# Altium project MC3_r2.PrjPcb (part 7 of 10)

## Sheet TPS_secondary_wiper.SchDoc
size A; DocumentNumber: D_19; SheetNumber: 19; SheetTotal: 21
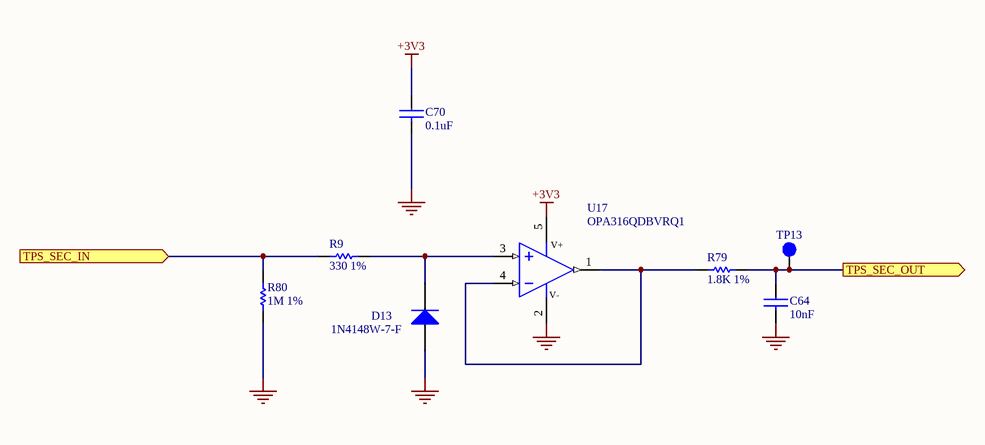
[diagram p13: TPS_secondary_wiper.SchDoc]

### Parts
C64  10nF  [C0805]
C70  0.1uF  [C0805]
D13  1N4148W-7-F  [DIOD-SOD123-2_V]
R9  330 1%  [R0805]
R79  1.8K 1%  [R0805]
R80  1M 1%  [R0805]
TP13  T  [TESTPOINTSMD_1x1MM]  (value not drawn)  (no BOM)
U17  OPA316QDBVRQ1  [DBV0005A_M]

### Ports
TPS_SEC_IN (in), TPS_SEC_OUT (out)

### Nets
+3V3: C70.1 U17.5(V+)
GND: C64.2 C70.2 D13.1(A) R80.1 U17.2(V-)
TPS_SEC: R9.1 R80.2 ; port TPS_SEC_IN
TPS_SECAD: C64.1 R79.2 TP13.1 ; port TPS_SEC_OUT
NetD13_2: D13.2(K) R9.2 U17.3(IN+)
NetR79_1: R79.1 U17.1(OUT) U17.4(IN-)

### Library data of the parts
C64 = CC0805KRX7R9BB103: YAGEO - CC0805KRX7R9BB103 - SMD Multilayer Ceramic Capacitor, 10000 pF, 50 V, 0805 [2012 Metric], ± 10%, X7R, CC Series; Voltage Rating: 50V; Insulation Resistance: 100GR; Supplier 1: Mouser; Supplier Part Number 1: 603-CC805KRX7R9BB103; Manufacturer: Yageo; Manufacturer Part Number: CC0805KRX7R9BB103; RoHS: Yes; Category: Ceramic Capacitors; Stock 1: 473100; Pricing 1: 1=0.11000, 10=0.05700, 100=0.02600, 1000=0.02100, 4000=0.01600, 8000=0.01400 (USD); Mount: Surface Mount; Case/Package: 0805; Number of Pins: 2; Case Code (Imperial): 0805; Case Code (Metric): 2012; Material: Ceramic; Min Operating Temperature: -55°C; Max Operating Temperature: 125°C; Packaging: Tape and Reel; Capacitance: 10nF; Tolerance: 10%; Package Quantity: 1; Dielectric: X7R; Termination: SMD/SMT; Voltage Rating (DC): 50V; Voltage: 50V; Composition: Ceramic; Length: 2mm; Height: 0.6mm; Width: 1.25mm; Depth: 1.25mm; Thickness: 0.024inch; Radiation Hardening: No; REACH SVHC: No SVHC; Lead Free: Lead Free; Halogen Free: Halogen Free; ComponentLink1URL: https://datasheet.ciiva.com/11786/0900766b80d84f1d-11786119.pdf?src-supplier=RSComponents; ComponentLink1Description: https://datasheet.ciiva.com/11786/0900766b80d84f1d-11786119.pdf?src-supplier=RSComponents; ComponentLink2URL: https://datasheet.ciiva.com/25613/0900766b8027bcf6-25613113.pdf?src-supplier=RSComponents; ComponentLink2Description: https://datasheet.ciiva.com/25613/0900766b8027bcf6-25613113.pdf?src-supplier=RSComponents; ComponentLink3URL: https://datasheet.ciiva.com/144/mlccorderingcode-144533.pdf?src-supplier=Digi-Key; ComponentLink3Description: https://datasheet.ciiva.com/144/mlccorderingcode-144533.pdf?src-supplier=Digi-Key; ComponentLink4URL: https://datasheet.ciiva.com/144/mlccorderingcode-144534.pdf?src-supplier=Digi-Key; ComponentLink4Description: https://datasheet.ciiva.com/144/mlccorderingcode-144534.pdf?src-supplier=Digi-Key; ComponentLink5URL: https://datasheet.ciiva.com/46372/1784427-46372638.pdf?src-supplier=Element14; ComponentLink5Description: https://datasheet.ciiva.com/46372/1784427-46372638.pdf?src-supplier=Element14; ComponentLink6URL: https://datasheet.ciiva.com/144/mlccorderingcode-144532.pdf?src-supplier=Digi-Key; ComponentLink6Description: https://datasheet.ciiva.com/144/mlccorderingcode-144532.pdf?src-supplier=Digi-Key; ComponentLink7URL: https://datasheet.ciiva.com/16625/upy-gphc-x7r-6-3v-to-50v-8-16625548.pdf?src-supplier=Avnet+Europe; ComponentLink7Description: https://datasheet.ciiva.com/16625/upy-gphc-x7r-6-3v-to-50v-8-16625548.pdf?src-supplier=Avnet+Europe; ComponentLink8URL: https://datasheet.ciiva.com/22749/1489800-22749215.pdf?src-supplier=Element14; ComponentLink8Description: https://datasheet.ciiva.com/22749/1489800-22749215.pdf?src-supplier=Element14; ComponentLink9URL: https://datasheet.ciiva.com/46372/1734573-46372639.pdf?src-supplier=Element14; ComponentLink9Description: https://datasheet.ciiva.com/46372/1734573-46372639.pdf?src-supplier=Element14
C70 = C0805C104K5RACTU: Cap Ceramic 0.1uF 50V X7R 10% SMD 2.0 x 1.2 mm 125 C Paper T/R; Manufacturer: KEMET; Capacitance: 100nF; Voltage: 500V; Supplier 1: Mouser; Supplier Part Number 1: 80-C0805C104K5R; Manufacturer Part Number: C0805C104K5RACTU; RoHS: Yes; Category: Ceramic Capacitors; Stock 1: 4177670; Pricing 1: 1=0.17000, 10=0.10400, 100=0.05600, 500=0.03900, 1000=0.03200, 4000=0.02400 (USD); Mount: Surface Mount,PCB; Case/Package: 0805; Number of Pins: 2; Case Code (Imperial): 0805; Case Code (Metric): 2012; Dielectric Material: Ceramic; Contact Plating: Tin,Matte; Min Operating Temperature: -55°C; Max Operating Temperature: 125°C; Voltage Rating: 50V; Tolerance: 10%; Packaging: Tape and Reel; Dielectric: X7R; Package Quantity: 4000; Voltage Rating (DC): 50V; Termination: SMD/SMT; Length: 2mm; Height: 0.9mm; Width: 1.2mm; Depth: 1.25mm; Thickness: 0.035inch; Lead Pitch: 0.75mm; Radiation Hardening: No; REACH SVHC: No SVHC; ComponentLink1URL: https://datasheet.ciiva.com/14589/70095383-14589048.pdf?src-supplier=Allied+Electronics; ComponentLink1Description: https://datasheet.ciiva.com/14589/70095383-14589048.pdf?src-supplier=Allied+Electronics; ComponentLink2URL: https://datasheet.ciiva.com/28682/1851736-28682232.pdf?src-supplier=Element14; ComponentLink2Description: https://datasheet.ciiva.com/28682/1851736-28682232.pdf?src-supplier=Element14; ComponentLink3URL: https://datasheet.ciiva.com/32431/slceramic-chip-condensers-e-32431755.pdf?src-supplier=Distrelec; ComponentLink3Description: https://datasheet.ciiva.com/32431/slceramic-chip-condensers-e-32431755.pdf?src-supplier=Distrelec; ComponentLink4URL: https://datasheet.ciiva.com/18410/70095383-18410815.pdf?src-supplier=Allied+Electronics; ComponentLink4Description: https://datasheet.ciiva.com/18410/70095383-18410815.pdf?src-supplier=Allied+Electronics
D13 = 1N4148W-7-F: DIODE GEN PURP 100V 300MA SOD123; Manufacturer: Diodes; Reverse Recovery Time: 4ns; Forward Voltage: 1.25V; Element Configuration: Single; Forward Current: 150mA; Peak Non-Repetitive Surge Current: 2A; Power Dissipation: 400mW; Peak Reverse Current: 1uA; Polarity: Standard; Voltage Rating (DC): 75V; Capacitance: 2pF; Current: 15A; Supplier 1: Mouser; Supplier Part Number 1: 621-1N4148W-F; Manufacturer Part Number: 1N4148W-7-F; RoHS: Yes; Category: Rectifier Diodes; Stock 1: 1274151; Pricing 1: 1=0.16000, 10=0.15000, 100=0.05300, 1000=0.03500, 3000=0.02700, 9000=0.02400 (USD); Mount: Surface Mount; Number of Pins: 2; Weight: 0.000353oz; Contact Plating: Tin,Matte; Min Operating Temperature: -65°C; Max Operating Temperature: 150°C; Packaging: Tape and Reel; Max Repetitive Reverse Voltage (Vrrm): 100V; Package Quantity: 3000; Average Rectified Current: 300mA; Max Reverse Voltage (DC): 100V; Recovery Time: 4ns; Max Forward Surge Current (Ifsm): 2A; Max Surge Current: 2A; Current Rating: 150mA; Output Current: 150mA; Voltage: 100V; Power Rating: 400mW; Length: 2.85mm; Height: 1.25mm; Width: 1.7mm; Radiation Hardening: No; Lead Free: Lead Free; REACH SVHC: No SVHC; ComponentLink1URL: https://datasheet.ciiva.com/4435/ds30086-4435128.pdf?src-supplier=Mouser; ComponentLink1Description: https://datasheet.ciiva.com/4435/ds30086-4435128.pdf?src-supplier=Mouser; ComponentLink2URL: https://datasheet.ciiva.com/8300/ds30086-8300392.pdf?src-supplier=Avnet; ComponentLink2Description: https://datasheet.ciiva.com/8300/ds30086-8300392.pdf?src-supplier=Avnet; ComponentLink3URL: https://datasheet.ciiva.com/911/ds30086-911734.pdf?src-supplier=Digi-Key; ComponentLink3Description: https://datasheet.ciiva.com/911/ds30086-911734.pdf?src-supplier=Digi-Key; ComponentLink4URL: https://datasheet.ciiva.com/911/ds30086-911735.pdf?src-supplier=Digi-Key; ComponentLink4Description: https://datasheet.ciiva.com/911/ds30086-911735.pdf?src-supplier=Digi-Key; ComponentLink5URL: https://datasheet.ciiva.com/22695/1915529-22695239.pdf?src-supplier=Element14; ComponentLink5Description: https://datasheet.ciiva.com/22695/1915529-22695239.pdf?src-supplier=Element14; ComponentLink6URL: https://datasheet.ciiva.com/911/ds30086-911736.pdf?src-supplier=Digi-Key; ComponentLink6Description: https://datasheet.ciiva.com/911/ds30086-911736.pdf?src-supplier=Digi-Key; ComponentLink7URL: https://datasheet.ciiva.com/1179/1915529-1179304.pdf?src-supplier=Element14; ComponentLink7Description: https://datasheet.ciiva.com/1179/1915529-1179304.pdf?src-supplier=Element14; ComponentLink8URL: https://datasheet.ciiva.com/25919/ds30086-25919609.pdf?src-supplier=Avnet+Europe; ComponentLink8Description: https://datasheet.ciiva.com/25919/ds30086-25919609.pdf?src-supplier=Avnet+Europe; ComponentLink9URL: https://datasheet.ciiva.com/15219/getdatasheetpartid-110030-15219548.pdf?src-supplier=Verical; ComponentLink9Description: https://datasheet.ciiva.com/15219/getdatasheetpartid-110030-15219548.pdf?src-supplier=Verical; ComponentLink10URL: https://datasheet.ciiva.com/8303/ds30086-8303197.pdf?src-supplier=Avnet; ComponentLink10Description: https://datasheet.ciiva.com/8303/ds30086-8303197.pdf?src-supplier=Avnet
R9 = ERJ-6ENF3300V: RES SMD 330 OHM 1% 1/8W 0805; Manufacturer: Panasonic; Resistance: 330R; Temperature Coefficient: 100ppm/°C; Power Rating: 125mW; Voltage Rating: 150V; Supplier 1: Mouser; Supplier Part Number 1: 667-ERJ-6ENF3300V; Manufacturer Part Number: ERJ-6ENF3300V; RoHS: Yes; Category: Chip SMD Resistors; Stock 1: 121287; Pricing 1: 1=0.10000, 10=0.08900, 100=0.03500, 500=0.03500, 1000=0.01900, 5000=0.01700 (USD); Case/Package: 0805; Case Code (Imperial): 0805; Case Code (Metric): 2012; Contact Plating: Tin; Min Operating Temperature: -55°C; Max Operating Temperature: 155°C; Tolerance: 1%; Packaging: Tape and Reel; Composition: Thick Film; Termination: SMD/SMT; Package Quantity: 1; Military Standard: Not; Length: 2mm; Height: 0.6mm; Width: 1.2mm; Depth: 1.25mm; Radiation Hardening: No; REACH SVHC: No SVHC; ComponentLink1URL: https://datasheet.ciiva.com/11821/0900766b80f80784-11821635.pdf?src-supplier=RSComponents; ComponentLink1Description: https://datasheet.ciiva.com/11821/0900766b80f80784-11821635.pdf?src-supplier=RSComponents; ComponentLink2URL: https://datasheet.ciiva.com/30131/aoa0000ce2-30131349.pdf?src-supplier=Onlinecomponents.com; ComponentLink2Description: https://datasheet.ciiva.com/30131/aoa0000ce2-30131349.pdf?src-supplier=Onlinecomponents.com; ComponentLink3URL: https://datasheet.ciiva.com/24025/aoa0000ce2-24025991.pdf?src-supplier=Mouser; ComponentLink3Description: https://datasheet.ciiva.com/24025/aoa0000ce2-24025991.pdf?src-supplier=Mouser; ComponentLink4URL: https://datasheet.ciiva.com/17206/aoa0000ce2-17206152.pdf?src-supplier=Avnet+Europe; ComponentLink4Description: https://datasheet.ciiva.com/17206/aoa0000ce2-17206152.pdf?src-supplier=Avnet+Europe; ComponentLink5URL: https://datasheet.ciiva.com/46436/1678782-46436633.pdf?src-supplier=Element14; ComponentLink5Description: https://datasheet.ciiva.com/46436/1678782-46436633.pdf?src-supplier=Element14; ComponentLink6URL: https://datasheet.ciiva.com/46436/1678782-46436634.pdf?src-supplier=Element14; ComponentLink6Description: https://datasheet.ciiva.com/46436/1678782-46436634.pdf?src-supplier=Element14; ComponentLink7URL: https://datasheet.ciiva.com/16760/70260748-16760668.pdf?src-supplier=Allied+Electronics; ComponentLink7Description: https://datasheet.ciiva.com/16760/70260748-16760668.pdf?src-supplier=Allied+Electronics; ComponentLink8URL: https://datasheet.ciiva.com/16780/70260748-16780764.pdf?src-supplier=Allied+Electronics; ComponentLink8Description: https://datasheet.ciiva.com/16780/70260748-16780764.pdf?src-supplier=Allied+Electronics; ComponentLink9URL: https://datasheet.ciiva.com/22684/1678782-22684798.pdf?src-supplier=Element14; ComponentLink9Description: https://datasheet.ciiva.com/22684/1678782-22684798.pdf?src-supplier=Element14; ComponentLink10URL: https://datasheet.ciiva.com/28590/1678782-28590783.pdf?src-supplier=Element14; ComponentLink10Description: https://datasheet.ciiva.com/28590/1678782-28590783.pdf?src-supplier=Element14; Mount: Surface Mount; Number of Pins: 2; Number of Terminations: 2; Max Power Dissipation: 125mW; Features: Automotive AEC-Q200
R79 = ERJ-6ENF1801V: RESISTOR, 0805, 0.125W, 1%, 1K8; Manufacturer: Panasonic; Resistance: 1.8kR; Temperature Coefficient: 100ppm/°C; Voltage Rating: 150V; Power Rating: 125mW; Supplier 1: Mouser; Supplier Part Number 1: 667-ERJ-6ENF1801V; Manufacturer Part Number: ERJ-6ENF1801V; RoHS: Yes; Category: Chip SMD Resistors; Stock 1: 1306; Pricing 1: 1=0.12000, 10=0.08900, 100=0.03500, 1000=0.01700, 5000=0.01700, 10000=0.01700 (USD); Mount: Surface Mount; Case/Package: 0805; Number of Pins: 2; Case Code (Metric): 2012; Case Code (Imperial): 0805; Contact Plating: Tin; Min Operating Temperature: -55°C; Max Operating Temperature: 155°C; Packaging: Tape and Reel; Tolerance: 1%; Composition: Thick Film; Package Quantity: 1; Number of Terminations: 2; Max Power Dissipation: 125mW; Termination: SMD/SMT; Voltage Rating (DC): 150V; Features: Automotive AEC-Q200; Military Standard: Not; Length: 2mm; Height: 0.6mm; Width: 0.049inch; Depth: 1.25mm; REACH SVHC: No SVHC; ComponentLink1URL: https://datasheet.ciiva.com/11821/0900766b80f80784-11821574.pdf?src-supplier=RSComponents; ComponentLink1Description: https://datasheet.ciiva.com/11821/0900766b80f80784-11821574.pdf?src-supplier=RSComponents; ComponentLink2URL: https://datasheet.ciiva.com/17214/aoa0000ce2-17214517.pdf?src-supplier=Avnet+Europe; ComponentLink2Description: https://datasheet.ciiva.com/17214/aoa0000ce2-17214517.pdf?src-supplier=Avnet+Europe; ComponentLink3URL: https://datasheet.ciiva.com/7887/426256-7887030.pdf?src-supplier=Element14; ComponentLink3Description: https://datasheet.ciiva.com/7887/426256-7887030.pdf?src-supplier=Element14; ComponentLink4URL: https://datasheet.ciiva.com/16763/70260748-16763351.pdf?src-supplier=Allied+Electronics; ComponentLink4Description: https://datasheet.ciiva.com/16763/70260748-16763351.pdf?src-supplier=Allied+Electronics; ComponentLink5URL: https://datasheet.ciiva.com/22673/1678782-22673704.pdf?src-supplier=Element14; ComponentLink5Description: https://datasheet.ciiva.com/22673/1678782-22673704.pdf?src-supplier=Element14; ComponentLink6URL: https://datasheet.ciiva.com/46420/1678782-46420328.pdf?src-supplier=Element14; ComponentLink6Description: https://datasheet.ciiva.com/46420/1678782-46420328.pdf?src-supplier=Element14; ComponentLink7URL: https://datasheet.ciiva.com/16512/aoa0000ce2-16512137.pdf?src-supplier=Avnet+Asia; ComponentLink7Description: https://datasheet.ciiva.com/16512/aoa0000ce2-16512137.pdf?src-supplier=Avnet+Asia; ComponentLink8URL: https://datasheet.ciiva.com/6138/426256-6138778.pdf?src-supplier=Farnell; ComponentLink8Description: https://datasheet.ciiva.com/6138/426256-6138778.pdf?src-supplier=Farnell; ComponentLink9URL: https://datasheet.ciiva.com/16760/70260748-16760811.pdf?src-supplier=Allied+Electronics; ComponentLink9Description: https://datasheet.ciiva.com/16760/70260748-16760811.pdf?src-supplier=Allied+Electronics; ComponentLink10URL: https://datasheet.ciiva.com/24024/aoa0000ce2-24024172.pdf?src-supplier=Mouser; ComponentLink10Description: https://datasheet.ciiva.com/24024/aoa0000ce2-24024172.pdf?src-supplier=Mouser; ComponentLink11URL: https://datasheet.ciiva.com/7886/426256-7886751.pdf?src-supplier=Element14; ComponentLink11Description: https://datasheet.ciiva.com/7886/426256-7886751.pdf?src-supplier=Element14; ComponentLink12URL: https://datasheet.ciiva.com/30154/aoa0000ce2-30154047.pdf?src-supplier=Onlinecomponents.com; ComponentLink12Description: https://datasheet.ciiva.com/30154/aoa0000ce2-30154047.pdf?src-supplier=Onlinecomponents.com
R80 = ERJ-6ENF1004V: Res Thick Film 0805 1M Ohm 1% 1/8W 100ppm/C Molded SMD Punched Carrier T/R; Manufacturer: Panasonic; Resistance: 1MR; Temperature Coefficient: 100ppm/°C; Power Rating: 125mW; Voltage Rating: 150V; Supplier 1: Mouser; Supplier Part Number 1: 667-ERJ-6ENF1004V; Manufacturer Part Number: ERJ-6ENF1004V; RoHS: Yes; Category: Chip SMD Resistors; Stock 1: 196038; Pricing 1: 1=0.10000, 10=0.07300, 100=0.02800, 1000=0.01700, 5000=0.01700, 10000=0.01700, 25000=0.01400, 50000=0.01000, 100000=0.00900 (USD); Mount: Surface Mount; Case/Package: 0805; Number of Pins: 2; Case Code (Imperial): 0805; Case Code (Metric): 2012; Contact Plating: Tin; Min Operating Temperature: -55°C; Max Operating Temperature: 155°C; Packaging: Tape and Reel; Tolerance: 1%; Composition: Thick Film; Package Quantity: 1; Termination: SMD/SMT; Number of Terminations: 2; Max Power Dissipation: 125mW; Voltage Rating (DC): 150V; Features: Automotive AEC-Q200; Military Standard: Not; Length: 2mm; Height: 0.6mm; Width: 1.2mm; Depth: 1.25mm; Radiation Hardening: No; Lead Free: Lead Free; REACH SVHC: No SVHC; ComponentLink1URL: https://datasheet.ciiva.com/11821/0900766b80f80784-11821573.pdf?src-supplier=RSComponents; ComponentLink1Description: https://datasheet.ciiva.com/11821/0900766b80f80784-11821573.pdf?src-supplier=RSComponents; ComponentLink2URL: https://datasheet.ciiva.com/16761/70260748-16761141.pdf?src-supplier=Allied+Electronics; ComponentLink2Description: https://datasheet.ciiva.com/16761/70260748-16761141.pdf?src-supplier=Allied+Electronics; ComponentLink3URL: https://datasheet.ciiva.com/22749/426256-22749637.pdf?src-supplier=Element14; ComponentLink3Description: https://datasheet.ciiva.com/22749/426256-22749637.pdf?src-supplier=Element14; ComponentLink4URL: https://datasheet.ciiva.com/30161/aoa0000ce2-30161525.pdf?src-supplier=Onlinecomponents.com; ComponentLink4Description: https://datasheet.ciiva.com/30161/aoa0000ce2-30161525.pdf?src-supplier=Onlinecomponents.com; ComponentLink5URL: https://datasheet.ciiva.com/48532/aoa0000ce2-48532149.pdf?src-supplier=Avnet; ComponentLink5Description: https://datasheet.ciiva.com/48532/aoa0000ce2-48532149.pdf?src-supplier=Avnet; ComponentLink6URL: https://datasheet.ciiva.com/8079/426256-8079622.pdf?src-supplier=Element14; ComponentLink6Description: https://datasheet.ciiva.com/8079/426256-8079622.pdf?src-supplier=Element14; ComponentLink7URL: https://datasheet.ciiva.com/27055/1988997-27055735.pdf?src-supplier=Jameco; ComponentLink7Description: https://datasheet.ciiva.com/27055/1988997-27055735.pdf?src-supplier=Jameco; ComponentLink8URL: https://datasheet.ciiva.com/5868/426256-5868184.pdf?src-supplier=Farnell; ComponentLink8Description: https://datasheet.ciiva.com/5868/426256-5868184.pdf?src-supplier=Farnell; ComponentLink9URL: https://datasheet.ciiva.com/46420/1678782-46420186.pdf?src-supplier=Element14; ComponentLink9Description: https://datasheet.ciiva.com/46420/1678782-46420186.pdf?src-supplier=Element14; ComponentLink10URL: https://datasheet.ciiva.com/16788/70260748-16788299.pdf?src-supplier=Allied+Electronics; ComponentLink10Description: https://datasheet.ciiva.com/16788/70260748-16788299.pdf?src-supplier=Allied+Electronics; ComponentLink11URL: https://datasheet.ciiva.com/7909/426256-7909229.pdf?src-supplier=Element14; ComponentLink11Description: https://datasheet.ciiva.com/7909/426256-7909229.pdf?src-supplier=Element14; ComponentLink12URL: https://datasheet.ciiva.com/15158/getdatasheetpartid-246555-15158845.pdf?src-supplier=Verical; ComponentLink12Description: https://datasheet.ciiva.com/15158/getdatasheetpartid-246555-15158845.pdf?src-supplier=Verical; ComponentLink13URL: https://datasheet.ciiva.com/16449/aoa0000ce2-16449407.pdf?src-supplier=Future+Electronics; ComponentLink13Description: https://datasheet.ciiva.com/16449/aoa0000ce2-16449407.pdf?src-supplier=Future+Electronics; ComponentLink14URL: https://datasheet.ciiva.com/17215/aoa0000ce2-17215247.pdf?src-supplier=Avnet+Europe; ComponentLink14Description: https://datasheet.ciiva.com/17215/aoa0000ce2-17215247.pdf?src-supplier=Avnet+Europe
TP13 = TestPoint_SMD_1x1: SMD Test Point
U17 = OPA316QDBVRQ1: Op Amp Single Low Power Amplifier R-R I/O ±2.75V/5.5V Automotive 5-Pin SOT-23 T/R; Manufacturer: Texas Instruments; Number of Circuits: 1; Slew Rate: 6V/µs; Gain Bandwidth Product: 10MHz; Input Bias Current: 5pA; Input Offset Voltage (Vos): 500uV; Operating Supply Current: 400uA; Output Current per Channel: 50mA; Supplier 1: Mouser; Supplier Part Number 1: 595-OPA316QDBVRQ1; Manufacturer Part Number: OPA316QDBVRQ1; RoHS: No; Category: Amplifiers - Op Amps, Buffer, Instrumentation; Stock 1: 4457; Pricing 1: 1=1.37000, 10=1.16000, 100=0.89100, 250=0.78700, 500=0.74600, 1000=0.58000 (USD); Mount: Surface Mount; Case/Package: SOT-23-5; Min Operating Temperature: -40°C; Max Operating Temperature: 125°C; Packaging: Tape and Reel; Number of Channels: 1; ComponentLink1URL: http://www.ti.com/lit/ds/symlink/opa316-q1.pdf?src-supplier=Digi-Key; ComponentLink1Description: http://www.ti.com/lit/ds/symlink/opa316-q1.pdf?src-supplier=Digi-Key